# Altium schematic sheet [04] - PSU_+5V_AUX.SchDoc
size 297 x 209 mm; CompanyName: Wave; SheetNumber: 5; SheetTotal: 5; PRJ_SheetSize: A4
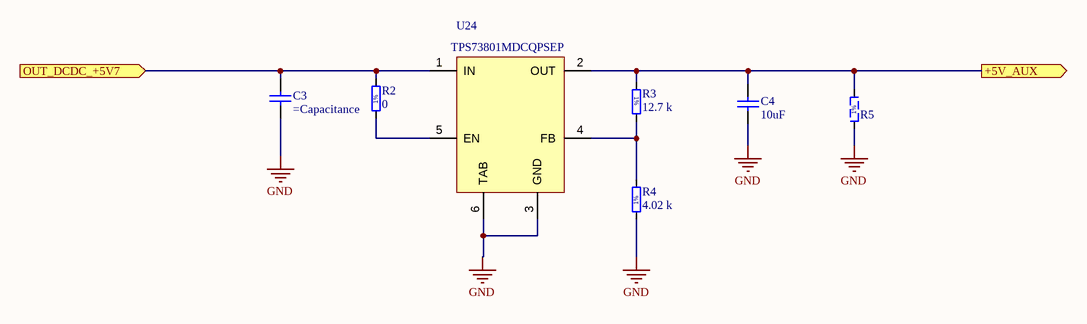
[diagram p0: [04] - PSU_+5V_AUX.SchDoc]

## Parts
C3  (no value)  [CAPC100X55X55L35N]
C4  10uF  [CAPC320X160X180L55N]
R2  0  [RESC100X50X40L25N]
R3  12.7 k  [RESC100X50X40L25N]
R4  4.02 k  [RESC100X50X40L25N]
R5  NoBom  [RESC2012X60N]  (value not drawn)  (no BOM)
U24  TPS73801MDCQPSEP  [SOT127P706X180-6N]

## Ports
+5V_AUX (out, see [01] - PCU_MODULE[3A]), OUT_DCDC_+5V7 (in, see [01] - PCU_MODULE[3A], [02] - DCDC_+5V7[4A])

## Nets
GND: C3.1 C4.1 R4.1 R5.1 U24.3(GND) U24.6(TAB)
+5V_AUX: C4.2 R3.1 R5.2 U24.2(OUT) ; port +5V_AUX
OUT_DCDC_+5V7: C3.2 R2.2 U24.1(IN) ; port OUT_DCDC_+5V7
NetR2_1: R2.1 U24.5(EN)
NetR3_2: R3.2 R4.2 U24.4(FB)

## Notes on the sheet
- Part Number:
- Description:
- Document:
- Date:
- Size:
- Sheet Title:
- Sheet
- of
- Author:
- MOD. COD.:
- (in symbol 1RES_NO_BOM_0805) 1%
- (in symbol CRCW04024K02FKED) 1%
- (in symbol CRCW040212K7FKED) 1%
- (in symbol CRCW04020000Z0EDC) 1%

## Library data of the parts
C3 = GRM155R71E223JA61: Multilayer Ceramic Capacitor, 0.022 uF, 25 V, ± 5%, X7R, 0402 [1005 Metric]; Manufacturer: Murata; Manufacturer Part Number: GRM155R71E223JA61D; Material: 4241ConductorMaterial; Supplier: Farnell; Supplier Part Number: 3582812; RoHS: Yes; Category: Ceramic Capacitors; Stock: 11149; Pricing: 10=0,017, 100=0,013, 500=0,012, 2500=0,0118, 5000=0,0115 (EUR); ComponentLink1URL: https://datasheet.ciiva.com/5427/product-5427580.pdf?src-supplier=Mouser; ComponentLink1Description: https://datasheet.ciiva.com/5427/product-5427580.pdf?src-supplier=Mouser; ComponentLink2URL: https://datasheet.ciiva.com/29535/grm155r71e223ka61-01-29535418.pdf?src-supplier=Digikey; ComponentLink2Description: https://datasheet.ciiva.com/29535/grm155r71e223ka61-01-29535418.pdf?src-supplier=Digikey
C4 = C3216X7R1H106K160AC: CAP CER 10UF 50V X7R 1206; Manufacturer: TDK; Material: 4241ConductorMaterial; Tolerance: 10%; Dielectric: 1511DielectricType; Supplier 1: Avnet; Manufacturer Part Number: C3216X7R1H106K160AC; RoHS: Yes; Category: Ceramic Capacitors; Stock 1: 19909; Pricing 1: 1=0,797, 10=0,603, 25=0,57, 50=0,537, 100=0,505 (USD); Mount: Surface Mount; Case/Package: 1206; Case Code (Imperial): 1206; Case Code (Metric): 3216; Min Operating Temperature: -55°C; Max Operating Temperature: 125°C; Series: C; Packaging: Cut Tape; Capacitance: 10uF; Voltage Rating: 50V; Voltage Rating (DC): 50V; Length: 3.2mm; Width: 1.6mm; Height: 1.9mm; Thickness: 1.6mm; RoHS Compliant: Yes; Lead Free: 5697LeadFree; ComponentLink1URL: https://product.tdk.com/info/en/catalog/datasheets/mlcc_commercial_general_en.pdf?src-supplier=Digikey; ComponentLink1Description: https://product.tdk.com/info/en/catalog/datasheets/mlcc_commercial_general_en.pdf?src-supplier=Digikey; ComponentLink2URL: https://datasheet.octopart.com/C3216X7R1H106K160AC-TDK-datasheet-159617022.pdf?src-supplier=TME; ComponentLink2Description: https://datasheet.octopart.com/C3216X7R1H106K160AC-TDK-datasheet-159617022.pdf?src-supplier=TME; Supplier Part Number 1: 71AH3370
R2 = CRCW04020000Z0EDC: RES 0 OHM 1/16W 1% 0402; Manufacturer: Vishay; Temperature Coefficient: ±100 ppm/ °C; Power (Watts): 0,063 W, 1/16 W; Supplier 1: Digi-Key; Manufacturer Part Number: CRCW04020000Z0EDC; Resistance: 0; Tolerance: ±1%; ComponentLink1URL: http://www.vishay.com/docs/28773/crcwce3.pdf?src-supplier=Digi-Key; ComponentLink1Description: http://www.vishay.com/docs/28773/crcwce3.pdf?src-supplier=Digi-Key; Supplier Part Number 1: 541-4062-1-ND; Manufacturer 1: Vishay; Manufacturer Part Number 1: CRCW04020000Z0EDC; Category: Resistors; Composition: Thick Film; Features: AEC Q100 automotive; Footprint Name: RESC100X50X40L25N; Operating Temperature: -55 °C ~ 155 °C; Package / Case: 0402 (1005 metrico); Packaging: Cut Tape (CT); Part Status: Active; Description 1: RES 0 OHM 1/16W 1% 0402
R3 = CRCW040212K7FKED: RES 12K7 OHM 1/16W 1% 0402; Manufacturer: Vishay Dale; Power (Watts): 0,063 W, 1/16 W; Temperature Coefficient: ±100 ppm/ °C; Category: Resistors; Resistance: 12K7; Tolerance: ±1%; Footprint Name: RESC1005X40N; ComponentLink1URL: http://www.vishay.com/docs/20035/dcrcwe3.pdf; ComponentLink1Description: Datasheet; Packaging: Cut Tape (CT); Supplier Part Number 1: 541-12.7KLCT-ND; Supplier 1: Digi-Key; Features: AEC Q100 automotive; Operating Temperature: -55 °C ~ 155 °C; Package / Case: 0402 (1005 metrico); Manufacturer Part Number: CRCW040212K7FKED; Part Status: Active; Composition: Thick Film; Manufacturer 1: Vishay Dale; Manufacturer Part Number 1: CRCW040212K7FKED
R4 = CRCW04024K02FKED: RES 4K02 OHM 1/16W 1% 0402; Manufacturer: Vishay Dale; Power (Watts): 0,063 W, 1/16 W; Temperature Coefficient: ±100 ppm/ °C; Category: Resistors; Resistance: 4K02; Tolerance: ±1%; Footprint Name: RESC1005X40N; ComponentLink1URL: http://www.vishay.com/docs/20035/dcrcwe3.pdf; ComponentLink1Description: Datasheet; Packaging: Cut Tape (CT); Supplier Part Number 1: 541-4.02KLCT-ND; Supplier 1: DigiKey; Features: AEC Q100 automotive; Operating Temperature: -55 °C ~ 155 °C; Package / Case: 0402 (1005 metrico); Manufacturer Part Number: CRCW04024K02FKED; Part Status: Active; Composition: Thick Film; Manufacturer 1: Vishay Dale; Manufacturer Part Number 1: CRCW04024K02FKED
R5 = 1RES_NO_BOM_0805: Resistore Non in BOM; Category: Resistors
U24 = TPS73801MDCQPSEP: LDO Voltage Regulators Radiation-tolerant, 2.2-V to 20-V input, 1-A adjustable LDO regulator in a plastic package 6-SOT-223 -55 to 125; Manufacturer: Texas Instruments; Voltage - Output: 1.21V ~ -20 V; Current - Output: 1A; Voltage - Input: 1.4V ~ -20 V; Number of Regulators: 1; Regulator Type: Positive Adjustable; Supplier: Mouser; Supplier Part Number: 595-TPS73801MDCQPSEP; Manufacturer Part Number: TPS73801MDCQPSEP; RoHS: RoHS Compliant; Category: Regulators; Packaging: Cut Tape (CT); Part Status: Active; Operating Temperature: -55°C ~ 125°C; Mounting Type: Surface Mount; Package / Case: SOT-223 (6); ComponentLink1URL: https://www.ti.com/lit/ds/symlink/tps73801-sep.pdf?ts=1731944378746&ref_url=https%253A%252F%252Fwww.ti.com%252Fproduct%252FTPS73801-SEP; ComponentLink1Description: Datasheet